# EAGLE design Edwin GM12006 (EAGLE 9.3.0)
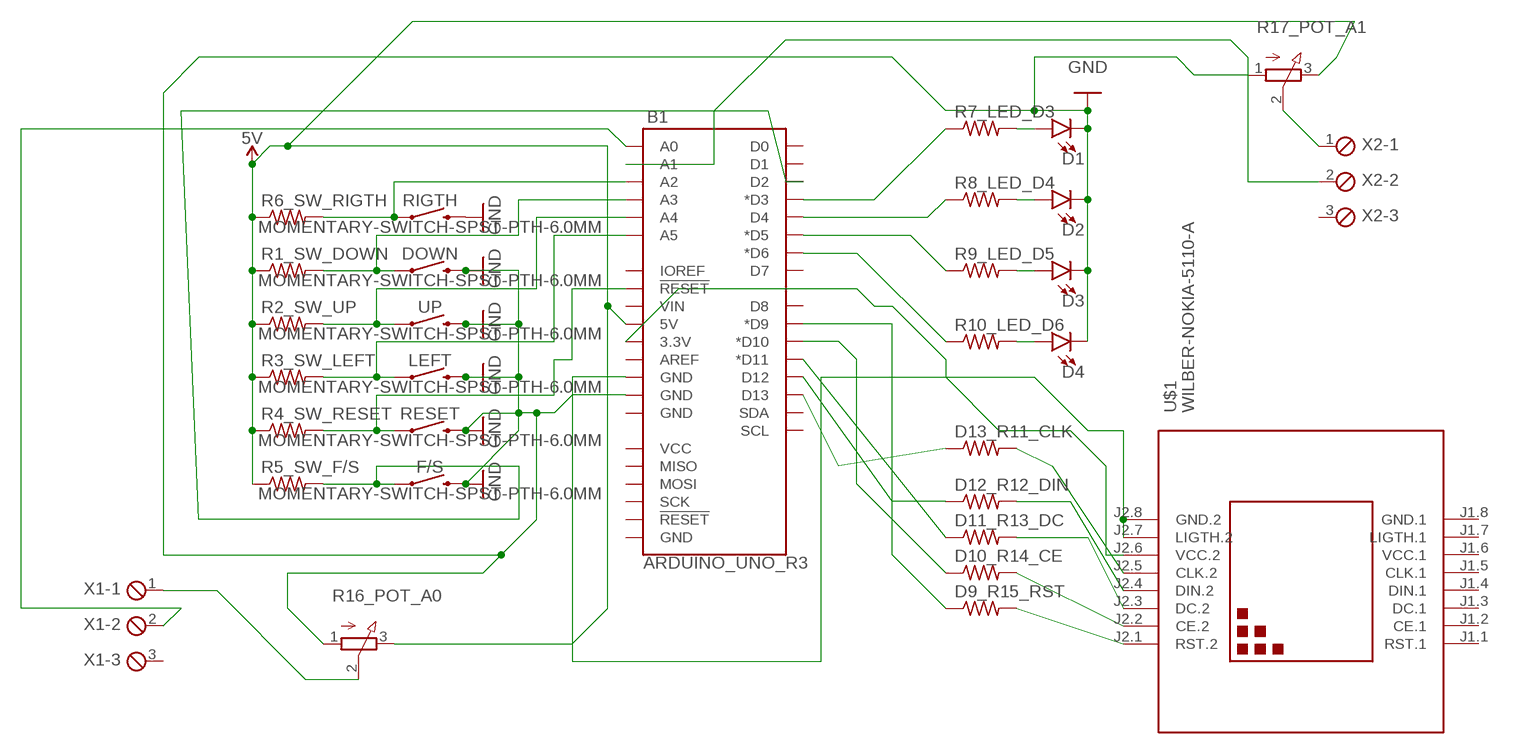
[diagram p0: schematic, sheet 1]

## Parts
B1  ARDUINO_UNO_R3  [ARDUINO_R3]
D1  LED5MM  [LED_5MM]
D2  LED5MM  [LED_5MM]
D3  LED5MM  [LED_5MM]
D4  LED5MM  [LED_5MM]
D9_R15_RST  R-US_0207/10  [0207/10]
D10_R14_CE  R-US_0207/10  [0207/10]
D11_R13_DC  R-US_0207/10  [0207/10]
D12_R12_DIN  R-US_0207/10  [0207/10]
D13_R11_CLK  R-US_0207/10  [0207/10]
DOWN  MOMENTARY-SWITCH-SPST-PTH-6.0MM  [TACTILE_SWITCH_PTH_6.0MM]
F/S  MOMENTARY-SWITCH-SPST-PTH-6.0MM  [TACTILE_SWITCH_PTH_6.0MM]
LEFT  MOMENTARY-SWITCH-SPST-PTH-6.0MM  [TACTILE_SWITCH_PTH_6.0MM]
R1_SW_DOWN  R-US_0207/10  [0207/10]
R2_SW_UP  R-US_0207/10  [0207/10]
R3_SW_LEFT  R-US_0207/10  [0207/10]
R4_SW_RESET  R-US_0207/10  [0207/10]
R5_SW_F/S  R-US_0207/10  [0207/10]
R6_SW_RIGTH  R-US_0207/10  [0207/10]
R7_LED_D3  R-US_0207/10  [0207/10]
R8_LED_D4  R-US_0207/10  [0207/10]
R9_LED_D5  R-US_0207/10  [0207/10]
R10_LED_D6  R-US_0207/10  [0207/10]
R16_POT_A0  3RP/1610N  [3RP/1610N]
R17_POT_A1  3RP/1610N  [3RP/1610N]
RESET  MOMENTARY-SWITCH-SPST-PTH-6.0MM  [TACTILE_SWITCH_PTH_6.0MM]
RIGTH  MOMENTARY-SWITCH-SPST-PTH-6.0MM  [TACTILE_SWITCH_PTH_6.0MM]
U$1  WILBER-NOKIA-5110-A  [WILBER-NOKIA-5110-A]
UP  MOMENTARY-SWITCH-SPST-PTH-6.0MM  [TACTILE_SWITCH_PTH_6.0MM]
X1  MPT3  [3POL254]
X2  MPT3  [3POL254]

## Nets
5V: B1.5V R1_SW_DOWN.1 R2_SW_UP.1 R3_SW_LEFT.1 R4_SW_RESET.1 R5_SW_F/S.1 R6_SW_RIGTH.1 R16_POT_A0.3(E) R17_POT_A1.3(E)
GND: B1.GND@3(GND) D1.K(C) D2.K(C) D3.K(C) D4.K(C) DOWN.3 F/S.3 LEFT.3 R16_POT_A0.1(A) R17_POT_A1.1(A) RESET.3 RIGTH.3 UP.3
N$1: B1.A2 R6_SW_RIGTH.2 RIGTH.1
N$2: B1.A3 DOWN.1 R1_SW_DOWN.2
N$3: B1.A4 R2_SW_UP.2 UP.1
N$4: B1.A5 LEFT.1 R3_SW_LEFT.2
N$5: B1.RESET@1(!RESET!) R4_SW_RESET.2 RESET.1
N$6: B1.D2 F/S.1 R5_SW_F/S.2
N$7: D1.A R7_LED_D3.2
N$8: D2.A R8_LED_D4.2
N$9: D3.A R9_LED_D5.2
N$10: D4.A R10_LED_D6.2
N$11: B1.D3(*D3) R7_LED_D3.1
N$12: B1.D4 R8_LED_D4.1
N$13: B1.D5(*D5) R9_LED_D5.1
N$14: B1.D6(*D6) R10_LED_D6.1
N$15: D13_R11_CLK.2 U$1.J2.5(CLK.2)
N$16: D12_R12_DIN.2 U$1.J2.4(DIN.2)
N$17: B1.GND@4(GND) U$1.J2.7(LIGTH.2) U$1.J2.8(GND.2)
N$18: D11_R13_DC.2 U$1.J2.3(DC.2)
N$19: D10_R14_CE.2 U$1.J2.2(CE.2)
N$20: D9_R15_RST.2 U$1.J2.1(RST.2)
N$21: B1.D13 D13_R11_CLK.1
N$22: B1.D12 D12_R12_DIN.1
N$23: B1.D11(*D11) D11_R13_DC.1
N$24: B1.D10(*D10) D10_R14_CE.1
N$25: B1.D9(*D9) D9_R15_RST.1
N$26: B1.3.3V U$1.J2.6(VCC.2)
N$27: R16_POT_A0.2(S) X1.1
N$28: B1.A1 X2.2
N$30: B1.A0 X1.2
N$33: R17_POT_A1.2(S) X2.1
Unconnected: B1.AREF B1.D0 B1.D1 B1.D7 B1.D8 B1.GND@1(GND) B1.GND@2(GND) B1.IOREF B1.MISO B1.MOSI B1.RESET@2(!RESET!) B1.SCK B1.SCL B1.SDA B1.VCC B1.VIN U$1.J1.3(DC.1) U$1.J1.4(DIN.1) U$1.J1.5(CLK.1) U$1.J1.6(VCC.1) U$1.J1.7(LIGTH.1) U$1.J1.8(GND.1) X1.3 X2.3

## Power pins joined to a net without a drawn wire
CE.1: U$1.J1.2(CE.1)
RST.1: U$1.J1.1(RST.1)

## Library data of the parts
B1 = SparkFun-Boards:ARDUINO_UNO_R3: Arduino R3 Footprint with SPI header Arduino Uno R3 Compatible Footprint. Matches PCB size of the original board. SparkFun Products: SAMD21 Dev Breakout <https://www.sparkfun.com/products/13672> RedBoard <https://www.sparkfun.com/products/12757> R3 Stackable Headers <https://www.sparkfun.com/products/11417>
D1-D4 = SparkFun-LED:LED: LED (Generic) Standard schematic elements and footprints for 5mm, 3mm, 1206, and 0603 sized LEDs. Generic LEDs with no color specified.
D9_R15_RST D10_R14_CE D11_R13_DC D12_R12_DIN D13_R11_CLK R1_SW_DOWN R2_SW_UP R3_SW_LEFT R4_SW_RESET R5_SW_F/S R6_SW_RIGTH R7_LED_D3 R8_LED_D4 R9_LED_D5 R10_LED_D6 = rcl:R-US_: RESISTOR, American symbol; SPICEPREFIX: R
DOWN F/S LEFT RESET RIGTH UP = SparkFun-Switches:MOMENTARY-SWITCH-SPST: Momentary Switch (Pushbutton) - SPST Normally-open (NO) SPST momentary switches (buttons, pushbuttons). Variants PTH-12MM - 12mm square, through-hole Momentary Pushbutton Switch - 12mm Square <https://www.sparkfun.com/products/9190> (COM-09190) PTH-6.0MM, PTH-6.0MM-KIT - 6.0mm square, through-hole Mini Pushbutton Switch <https://www.sparkfun.com/products/97> (COM-00097) KIT package intended for soldering kit's - only one side of pads' copper is exposed. PTH-RIGHT-ANGLE-KIT - Right-angle, through-hole Right Angle Tactile Button <https://www.sparkfun.com/products/10791> - Used on SparkFun BigTime Watch Kit <https://www.sparkfun.com/products/11734> SMD-12MM - 12mm square, surface-mount Tactile Button - SMD (12mm) <https://www.sparkfun.com/products/12993> (COM-12993) Used on SparkFun PicoBoard <https://www.sparkfun.com/products/11888> SMD-4.5MM - 4.5mm Square Trackball Switch Used on SparkFun Blackberry Trackballer Breakout <https://www.sparkfun.com/products/13169> SMD-4.6MMX2.8MM - 4.60mm x 2.80mm, surface mount Used on SparkFun SAMD21 Mini Breakout <https://www.sparkfun.com/products/13664> SMD-5.2MM, SMD-5.2-REDUNDANT - 5.2mm square, surface-mount Mini Pushbutton Switch - SMD <https://www.sparkfun.com/products/8720> (COM-08720) Used on Arduino Pro Mini <https://www.sparkfun.com/products/11114> REDUNDANT package connects both switch circuits together SMD-6.0X3.5MM - 6.0 x 3.5mm, surface mount Momentary Reset Switch SMD <https://www.sparkfun.com/products/8229> (COM-08229) SMD-6.2MM-TALL - 6.2mm square, surface mount Tactile Button - SMD (6mm) <https://www.sparkfun.com/products/12992> Used on SparkFun Digital Sandbox <https://www.sparkfun.com/products/12651> SMD-RIGHT-ANGLE - Right-angle, surface mount Used on SparkFun Block for Intel® Edison - Arduino <https://www.sparkfun.com/products/13036>; PROD_ID: SWCH-08441; SF_SKU: COM-00097
R16_POT_A0 R17_POT_A1 = pot:3RP/1610N: 16mm Potentiometer one level Source: http://www.alphapotentiometers.net/html/16mm_pot_2.html
U$1 = DEA-EBB-Wilber:WILBER-NOKIA-5110-A: 84x48 Dot Matrix LCD Module based on Nokia 3310 display
X1 X2 = con-phoenix-254:MPT3: PHOENIX CONNECTOR; OC_FARNELL: unknown; OC_NEWARK: unknown

## Board
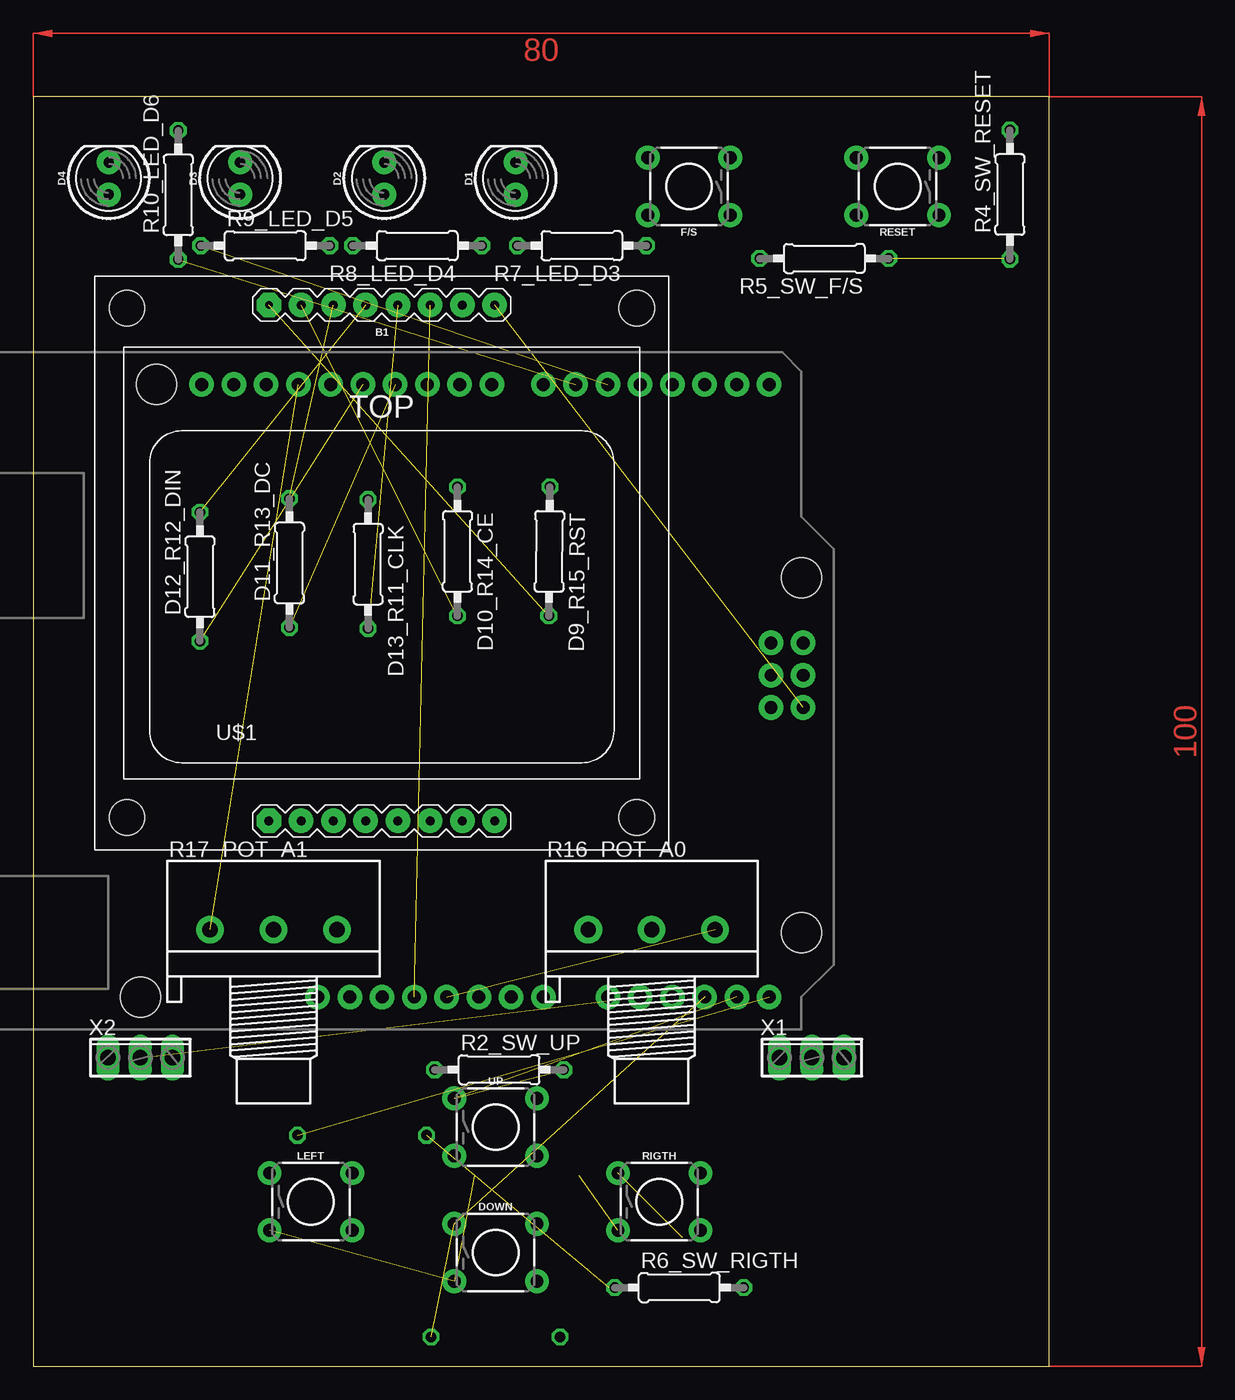
[diagram p1: board, top side]
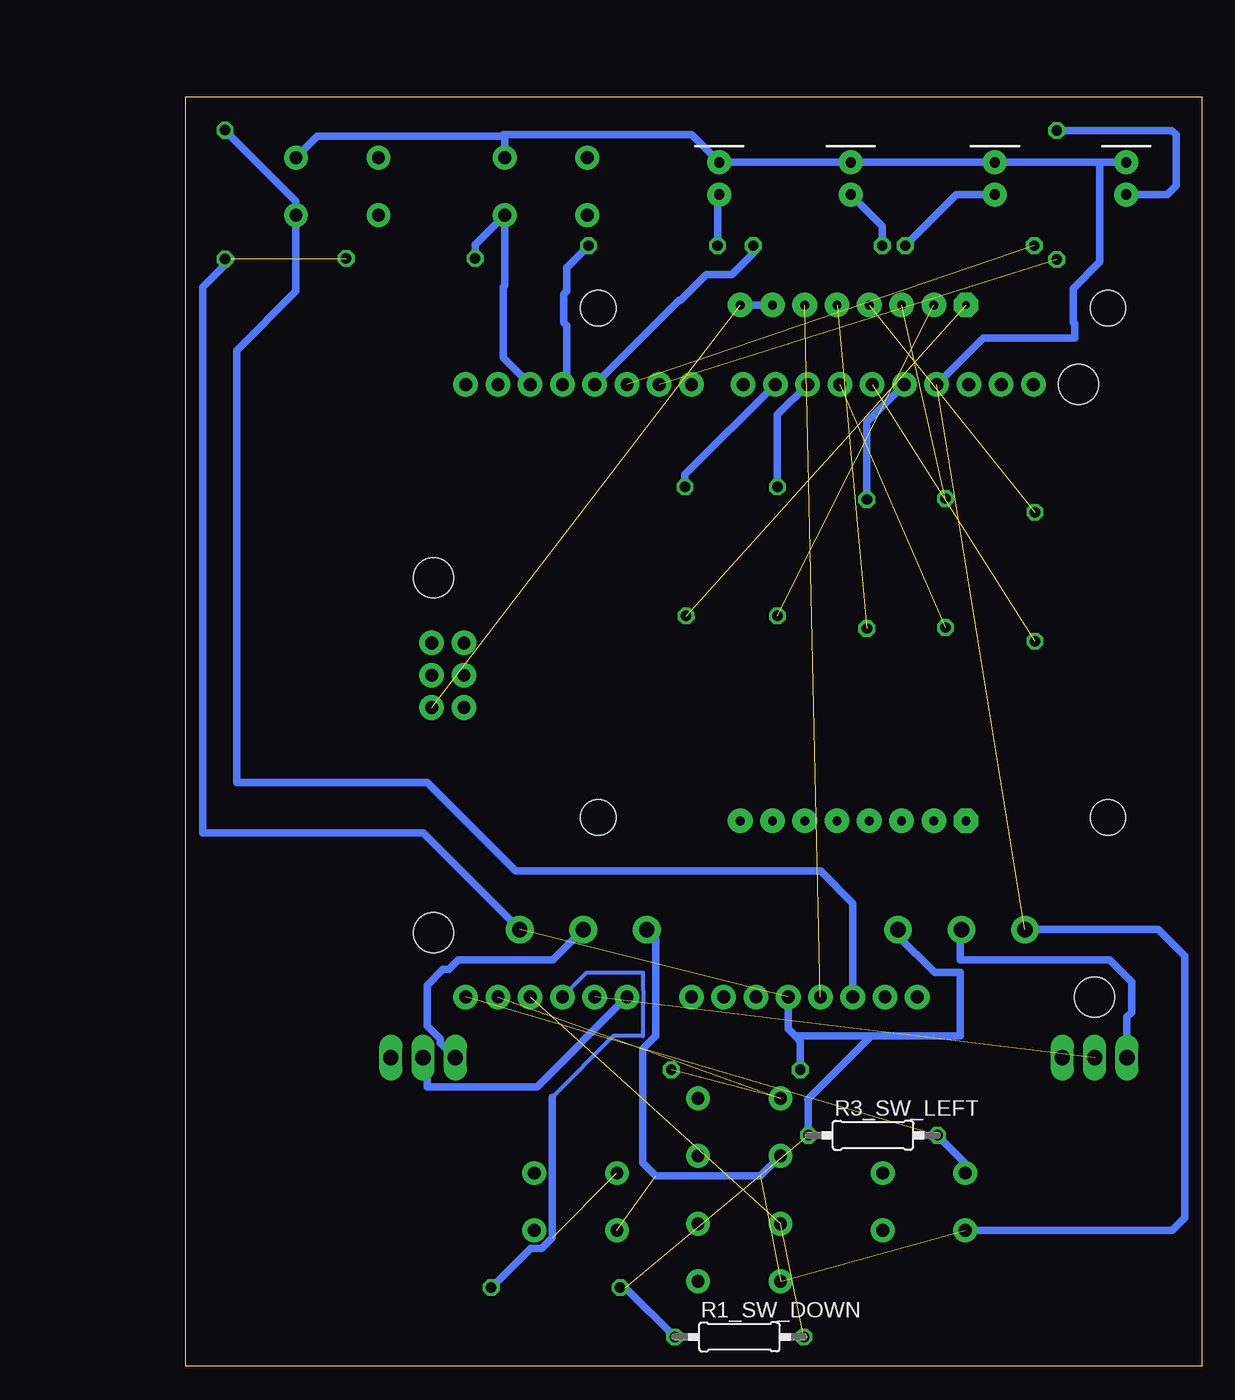
[diagram p2: board, bottom side, seen from below]

Size 80 x 100 mm. Coordinates in mm from the lower left corner, seen from the top.
Outline: 0,0 80,0 80,100 0,100 0,0
Copper layers (1*16): Top 0.035mm / dielectric 1.5mm / Bottom 0.035mm
Design rules "default": minimum track width 6mil, minimum drill 0.35mm, track to track 6mil, track to pad 6mil, pad to pad 6mil, via to via 6mil, smd to smd 6mil, copper to edge 40mil, drill to drill 6mil, minimum pad ring 10mil, minimum via ring 8mil, stop-mask expansion 4mil, vias tented up to drill 0mil, thermal gap 10mil

### Footprints (pad centres in the part's own frame; a part is rotated, then mirrored left to right if it is on the bottom)
ARDUINO_R3 = drill 1.016 pad 1.93: 3.3V 2.54,-24.13; 5V 5.08,-24.13; A0 17.78,-24.13; A1 20.32,-24.13; A2 22.86,-24.13; A3 25.4,-24.13; A4 27.94,-24.13; A5 30.48,-24.13; AREF -9.144,24.13; D0 30.48,24.13; D1 27.94,24.13; D2 25.4,24.13; D3 22.86,24.13; D4 20.32,24.13; D5 17.78,24.13; D6 15.24,24.13; D7 12.7,24.13; D8 8.636,24.13; D9 6.096,24.13; D10 3.556,24.13; D11 1.016,24.13; D12 -1.524,24.13; D13 -4.064,24.13; GND@1 7.62,-24.13; GND@2 10.16,-24.13; GND@3 -6.604,24.13; GND@4 33.16,-1.32; IOREF -2.54,-24.13; MISO 30.62,3.76; MOSI 33.16,1.22; NC -5.08,-24.13; RESET@1 0,-24.13; RESET@2 30.62,-1.32; SCK 30.62,1.22; SCL -14.224,24.13; SDA -11.684,24.13; VCC 33.16,3.76; VIN 12.7,-24.13 | hole 3.175: -17.78,24.13; 33.02,8.89; 33.02,-19.05; -19.05,-24.13
LED_5MM = drill 0.813 pad 1.88: A -1.27,0; K 1.27,0
0207/10 = drill 0.813 octagon: 1 -5.08,0; 2 5.08,0
TACTILE_SWITCH_PTH_6.0MM = drill 1.016 pad 1.88: 1 -3.251,2.261; 2 3.251,2.261; 3 -3.251,-2.261; 4 3.251,-2.261
3RP/1610N = drill 1.2 pad 2.184: 1 -5,0; 2 0,0; 3 5,0
WILBER-NOKIA-5110-A = drill 0.7 pad 1.93 octagon: J1.1 -8.89,-20.32 | drill 0.7 pad 1.93: J1.2 -6.35,-20.32; J1.3 -3.81,-20.32; J1.4 -1.27,-20.32; J1.5 1.27,-20.32; J1.6 3.81,-20.32; J1.7 6.35,-20.32; J1.8 8.89,-20.32; J2.2 -6.35,20.32; J2.3 -3.81,20.32; J2.4 -1.27,20.32; J2.5 1.27,20.32; J2.6 3.81,20.32; J2.7 6.35,20.32; J2.8 8.89,20.32 | drill 0.6 pad 1.93 octagon: J2.1 -8.89,20.32 | hole 2.8: -20.066,-20.066; 20.066,-20.066; 20.066,20.066; -20.066,20.066
3POL254 = drill 1.2 long: 1 -2.54,0; 2 0,0; 3 2.54,0

### Placement (x,y rotation side)
B1  27.47,53.21 0 top
D1  37.98,93.57 90 top
D2  27.63,93.57 90 top
D3  16.28,93.57 90 top
D4  5.93,93.57 90 top
D9_R15_RST  40.64,64.19 269.5 top
D10_R14_CE  33.4,64.19 270 top
D11_R13_DC  20.17,63.27 90 top
D12_R12_DIN  13.12,62.19 90 top
D13_R11_CLK  26.36,63.19 270 top
DOWN  36.41,8.95 0 top
F/S  51.63,92.95 180 top
LEFT  21.85,12.95 0 top
R1_SW_DOWN  36.4,2.3 0 bottom
R2_SW_UP  36.68,23.35 0 top
R3_SW_LEFT  25.88,18.19 0 bottom
R4_SW_RESET  76.91,92.3 90 top
R5_SW_F/S  62.29,87.27 180 top
R6_SW_RIGTH  50.87,6.19 0 top
R7_LED_D3  43.2,88.27 180 top
R8_LED_D4  30.23,88.27 180 top
R9_LED_D5  18.26,88.27 0 top
R10_LED_D6  11.41,92.27 90 top
R16_POT_A0  48.69,34.39 0 top
R17_POT_A1  18.91,34.39 0 top
RESET  68.07,92.95 180 top
RIGTH  49.29,12.95 0 top
U$1  27.44,63.28 0 top
UP  36.41,18.84 0 top
X1  61.31,24.3 0 top
X2  8.42,24.3 0 top

### Tracks (layer width: path | path; a pad name or v marks a point on that pad's centre or on a via)
5V  (3 unrouted)
  Bottom 0.61: R4_SW_RESET.1 76.86,87.27 76.41,87.27 78.68,85 78.68,42 61.3,42 R16_POT_A0.3 | B1.5V 32.55,26.55 32,26 | 32,26 26,26 | 26,26 19,26 19,31 21,31 23.91,33.91 R17_POT_A1.3 | R2_SW_UP.1 31.6,25.6 32,26 | R3_SW_LEFT.1 30.96,20.96 31,21 26,26 | R1_SW_DOWN.1 45.37,6.19 R6_SW_RIGTH.1
GND  (4 unrouted)
  Bottom 0.61: D4.K 8,94.84 | 8,94.84 D3.K D2.K D1.K 40.14,97 55,97 54.88,96.88 | B1.GND@3 17.21,81 10,81 10,82.12 10.1,82.22 10.1,84.91 8,87 8,94.84 | F/S.3 54.88,96.88 | 54.88,96.88 69.65,96.88 RESET.3 | R17_POT_A1.1 3.39,34.39 1.32,32.32 1.32,11.68 2.31,10.69 LEFT.3 | R16_POT_A0.1 43,33.7 43,26 44,25 44,16 43,15 34.74,15 UP.3
N$1  (1 unrouted)
  Bottom 0.305: B1.A2 48.41,31 44,31 44,29.63 43.98,29.61 43.98,28.55 44,28.53 44,26 46.32,26 51.14,21.17
  Bottom 0.61: R6_SW_RIGTH.2 52.85,9.29 51.96,9.29 51.14,10.11 51.14,21.17 | B1.A2 49.8,29.08
N$2  (2 unrouted)
N$3  (2 unrouted)
N$4  (1 unrouted)
  Bottom 0.61: R3_SW_LEFT.2 18.6,15.99 LEFT.1
N$5
  Bottom 0.61: R4_SW_RESET.2 71.32,91.79 RESET.1 71.32,84.68 76,80 76,46 61,46 54,39 30,39 27.47,36.47 B1.RESET@1
N$6
  Bottom 0.61: B1.D2 55,79.47 55,85 54.88,85.12 F/S.1 57.21,88.36 R5_SW_F/S.2
N$7
  Bottom 0.61: D1.A 38.12,92.16 R7_LED_D3.2
N$8
  Bottom 0.61: D2.A 25.15,89.82 R8_LED_D4.2
N$9
  Bottom 0.61: R9_LED_D5.2 19.31,92.3 D3.A
N$10
  Bottom 0.61: R10_LED_D6.2 2.35,97.35 2,97 2,93 2.7,92.3 D4.A
N$11
  Bottom 0.61: R7_LED_D3.1 50,86.55 50,84.7 50.23,84.47 50.23,82.22 50,81.99 50,77.67 B1.D3
N$12
  Bottom 0.61: B1.D4 41.13,84 41,84 39,86 37,86 35.31,87.69 R8_LED_D4.1
N$13  (1 unrouted)
N$14  (1 unrouted)
N$15  (1 unrouted)
N$16  (1 unrouted)
N$17  (1 unrouted)
  Bottom 0.61: U$1.J2.7 U$1.J2.8
N$18  (1 unrouted)
N$19  (1 unrouted)
N$20  (1 unrouted)
N$21
  Bottom 0.61: B1.D13 26.36,74.39 D13_R11_CLK.1
N$22  (1 unrouted)
N$23  (1 unrouted)
N$24
  Bottom 0.61: B1.D10 33.4,74.97 D10_R14_CE.1
N$25
  Bottom 0.61: B1.D9 40.68,70.22 D9_R15_RST.1
N$26  (1 unrouted)
N$27
  Bottom 0.61: R16_POT_A0.2 51.08,32 58.54,32 59.28,31.25 59.75,31.25 61,30 61,26.81 59.95,25.76 59.95,25.48 X1.1
N$28  (1 unrouted)
N$30
  Bottom 0.61: B1.A0 52.33,22 61,22 61,23.99 X1.2
N$33
  Bottom 0.61: X2.1 5.88,27.51 5.51,27.88 5.51,30.29 7.23,32 19,32 19,34.3 R17_POT_A1.2
(copper drawn outside any net)
  shapes: Top area x2